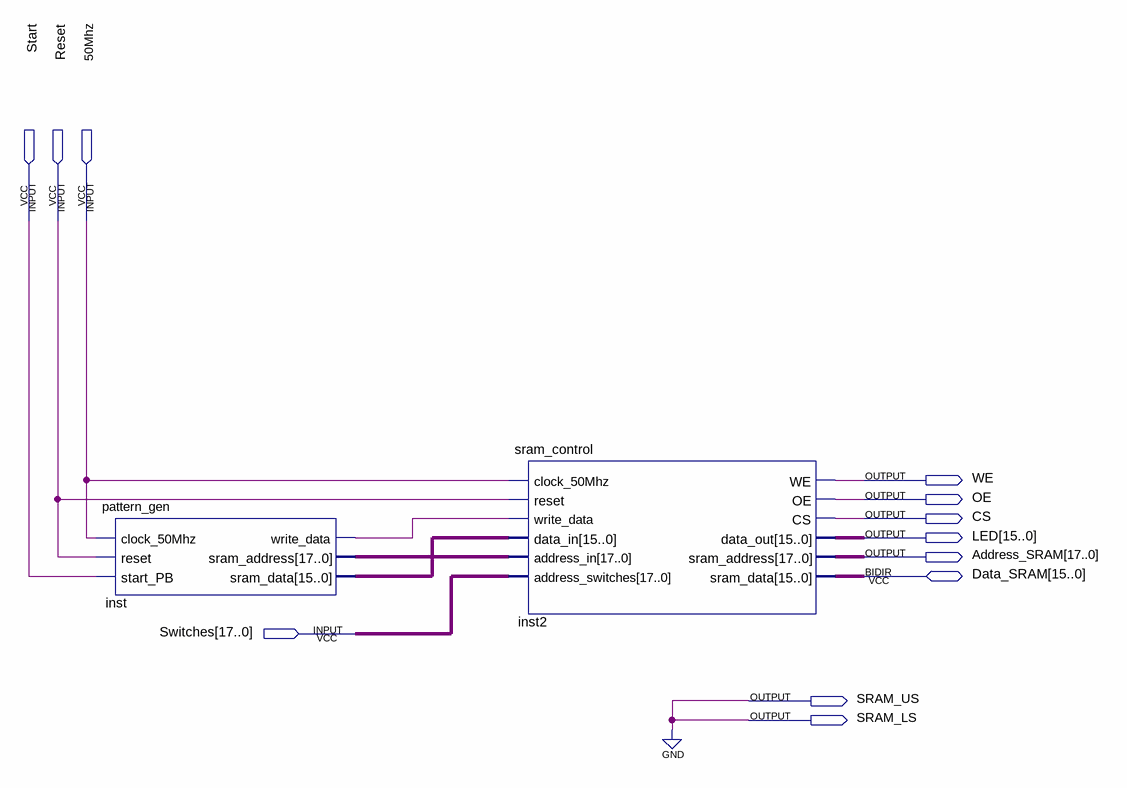
[diagram p0: schematic sheet]
// Quartus schematic test_no_lcd.bdf as structural Verilog: 2 symbols, 12 pins
module test_no_lcd (
  input  Start,
  input  Reset,
  input  \50Mhz ,
  input  [17:0] Switches,
  inout  [15:0] Data_SRAM,
  output WE,
  output OE,
  output CS,
  output [15:0] LED,
  output [17:0] Address_SRAM,
  output SRAM_US,
  output SRAM_LS
);

  wire inst_write_data;
  wire [15:0] inst_sram_data;
  wire [17:0] inst_sram_address;

  pattern_gen inst (
    .clock_50Mhz(\50Mhz ), .reset(Reset), .start_PB(Start), .write_data(inst_write_data),
    .sram_address(inst_sram_address), .sram_data(inst_sram_data));
  sram_control inst2 (
    .clock_50Mhz(\50Mhz ), .reset(Reset), .write_data(inst_write_data), .data_in(inst_sram_data),
    .address_in(inst_sram_address), .address_switches(Switches), .WE(WE), .OE(OE), .CS(CS), .data_out(LED),
    .sram_address(Address_SRAM), .sram_data(Data_SRAM));

  assign SRAM_LS = 1'b0;
  assign SRAM_US = 1'b0;
endmodule
